# Altium schematic sheet ZRPeripherals.SchDoc
size A4; PageSetup: Record=PageOptions|CenterHorizontal=False|CenterVertical=False|PrintScale=1.00|XCorrection=0.00|YCorrection=0.00|PrintKind=0|BorderSize=5000000|LeftOffset=0|BottomOffset=0|Orientation=2|PaperLength=1000|PaperWidth=1000|Scale=100|PaperSource=7|PrintQuality=-3|MediaType=1|DitherType=10|PrintScaleMode=1|PaperKind=A4|PaperIndex=9
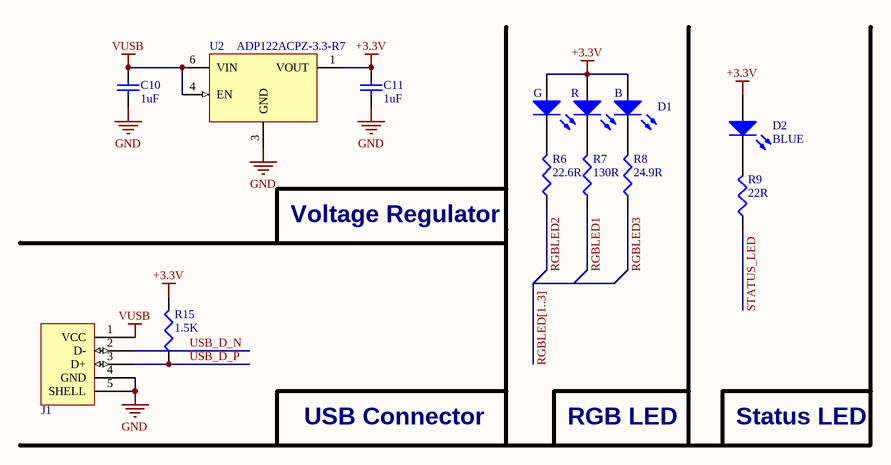
[diagram p0: ZRPeripherals.SchDoc]

## Parts
C10  1uF  [0603]
C11  1uF  [0603]
D1  SMLVN6RGB1W1  [3.5x2.8 mm 6-SMD]  (value not drawn)
D2  value BLUE  [0603 - LED]  (hidden comment: BLUE LED)
J1  48037-2200  [48037-2200]  (value not drawn)
R6  22.6R  [0402]
R7  130R  [0402]
R8  24.9R  [0402]
R9  22R  [0402]
R15  1.5K  [0402]
U2  ADP122ACPZ-3.3-R7  [LFCSP-6 2.0X2.0X0.55]

## Nets
+3.3V: C11.2 D1.1(AB) D1.2(AR) D1.3(AG) D2.1(A) R15.2 U2.1(VOUT)
GND: C10.1 C11.1 J1.4(GND) J1.5(SHELL) U2.2(NC) U2.3(GND) U2.5(NC) U2.7(THPAD)
VUSB: C10.2 J1.1(VCC) U2.4(EN) U2.6(VIN)
RGBLED1: R7.1
RGBLED2: R6.1
RGBLED3: R8.1
STATUS_LED: R9.1
USB_D_N: J1.2(D-)
USB_D_P: J1.3(D+) R15.1
NetD1_4: D1.4(KG) R6.2
NetD1_5: D1.5(KR) R7.2
NetD1_6: D1.6(KB) R8.2
NetD2_2: D2.2(K) R9.2

## Buses and harness runs
bus RGBLED[1..3]

## Notes on the sheet
- (near R6) Voltage Regulator
- USB Connector
- RGB LED
- Status LED
- (in symbol SMLVN6RGB1W1) G; R; B

## Library data of the parts
C10 C11 = 1uF: 1uF 0603 X5R 10V ±10%; Supplier 1: Farnell; Supplier Part Number 1: 1759399; Supplier 2: Digi-Key; Supplier Part Number 2: 478-1251-1-ND; Value: 1uF
D1 = SMLVN6RGB1W1: ROHM SMLVN6RGB1W1 LED Tri-Color Blue/Green/Red Chip LED 6-Pin 1411 T/RLED Tri-Color Blue/Green/Red Chip LED 6-Pin 1411; Supplier 1: Mouser; Supplier 2: Digi-Key; Supplier Part Number 1: 755-SMLVN6RGB1W1; Supplier Part Number 2: 846-1187-1-ND
D2 = BLUE LED: BRIGHT BLUE LED 20mA; Supplier 1: Farnell; Supplier Part Number 1: 1716770; Supplier 2: Digi-Key; Supplier Part Number 2: 160-1646-1-ND
J1 = 48037-2200: Molex USB 2.0 Connector Plug USB Type A; Supplier 1: Farnell; Supplier 2: Digi-Key; Supplier Part Number 1: 2313729; Supplier Part Number 2: WM3983CT-ND
R6 = 22.6R: 22.6R 0402 1/16W ±0.05R; Supplier 1: Farnell; Supplier 2: Digi-Key; Supplier Part Number 1: 2302454; Supplier Part Number 2: P22.6LCT-ND; Value: 22.6R
R7 = 130R: 130R 0402 1/16W ±0.05R; Supplier 1: Farnell; Supplier 2: Digi-Key; Supplier Part Number 1: 2059115; Supplier Part Number 2: P130LCT-ND; Value: 130R
R8 = 24.9R: 24.9R 0402 1/16W ±0.05R; Supplier 1: Farnell; Supplier 2: Digi-Key; Supplier Part Number 1: 2059102; Supplier Part Number 2: P24.9LCT-ND; Value: 24.9R
R9 = 22R: 22R 0402 1/16W ±1%; Supplier 1: Farnell; Supplier 2: Digi-Key; Supplier Part Number 1: 2072797; Supplier Part Number 2: 541-22.0LCT-ND; Value: 22R
R15 = 1.5K: 1.5K 0402 1/16W ±1%; Supplier 1: Farnell; Supplier Part Number 1: 1653201; Supplier 2: Digi-Key; Supplier Part Number 2: 541-1.50KLCT-ND; Value: 1.5K
U2 = ADP122ACPZ-3.3-R7: Analog Devices ADP122ACPZ-3.3-R7 - 5.5 V Input, 300 mA, Low Quiescent  Current, CMOS Linear Regulator; Supplier 1: Farnell; Supplier 2: Digi-Key; Supplier Part Number 1: 2457164; Supplier Part Number 2: ADP122ACPZ-3.3-R7CT-ND